# EAGLE schematic L001-Static-Schematic (EAGLE 7.7.0)
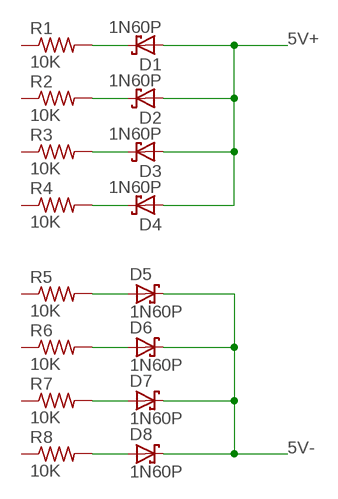
[diagram p0: schematic, sheet 1]

## Parts
D1  1N60P  1N5817-B  [DO41-7.6]
D2  1N60P  1N5817-B  [DO41-7.6]
D3  1N60P  1N5817-B  [DO41-7.6]
D4  1N60P  1N5817-B  [DO41-7.6]
D5  1N60P  1N5817-B  [DO41-7.6]
D6  1N60P  1N5817-B  [DO41-7.6]
D7  1N60P  1N5817-B  [DO41-7.6]
D8  1N60P  1N5817-B  [DO41-7.6]
R1  10K  R-US_VMTA55  [VMTA55]
R2  10K  R-US_VMTA55  [VMTA55]
R3  10K  R-US_VMTA55  [VMTA55]
R4  10K  R-US_VMTA55  [VMTA55]
R5  10K  R-US_VMTA55  [VMTA55]
R6  10K  R-US_VMTA55  [VMTA55]
R7  10K  R-US_VMTA55  [VMTA55]
R8  10K  R-US_VMTA55  [VMTA55]

## Nets
5V+: D1.A D2.A D3.A D4.A
5V-: D5.C D6.C D7.C D8.C
N$1: D5.A R5.2
N$2: D6.A R6.2
N$3: D7.A R7.2
N$4: D8.A R8.2
N$5: D1.C R1.2
N$6: D2.C R2.2
N$7: D3.C R3.2
N$8: D4.C R4.2
Unconnected: R1.1 R2.1 R3.1 R4.1 R5.1 R6.1 R7.1 R8.1

## Library data of the parts
D1-D8 = diode:1N581*: 1.0A SCHOTTKY BARRIER RECTIFIER Source: http://www.diodes.com/datasheets/ds23001.pdf
R1-R8 = resistor:R-US_: RESISTOR, American symbol